# Altium project Sayma_RTM.PrjPcb (part 2 of 11)

## Sheet FPGA_7A35T.SchDoc: Sayma RTM
size 420 x 297 mm; $$Internal___BlkDate: 23:43:20_12-13-18; $$Internal_NAME_PLACEHOLDER: a2sheet_WUT; $$Internal_Resolution: 00001mm; $$NotCommonProperty_@NAME: FPGA_7A35T; $$NotCommonProperty_@PRINTORDER: 9; $$NotCommonProperty_@SHEET: 1; $$NotCommonProperty_@SHEETTOTAL: 16; CmpIndex: 0; Drawing Author: G.Kasprowicz; Drawing Number: Sayma RTM; Drawing Project: 8 channel SAWG; Drawing Revision: 2.0; SymIndex: 2228; Author: G.Kasprowicz; CompanyName: WUT ISE; DrawnBy: G.Kasprowicz; Organization: WUT ISE; Address1: PW ISE; Address2: Nowowiejska 15/19 00-665 Warsaw; Address3: gkasprow@gmail.com; DocumentNumber: 8; Revision: 1.0; SheetNumber: 8; SheetTotal: 18; ModifiedBy: -; CheckedDate: -; Title2: FPGA IO banks; DivGrp: WUT ISE; Designer: G.Kasprowicz; ModifiedDate: -; ProjectName: Sensor Box
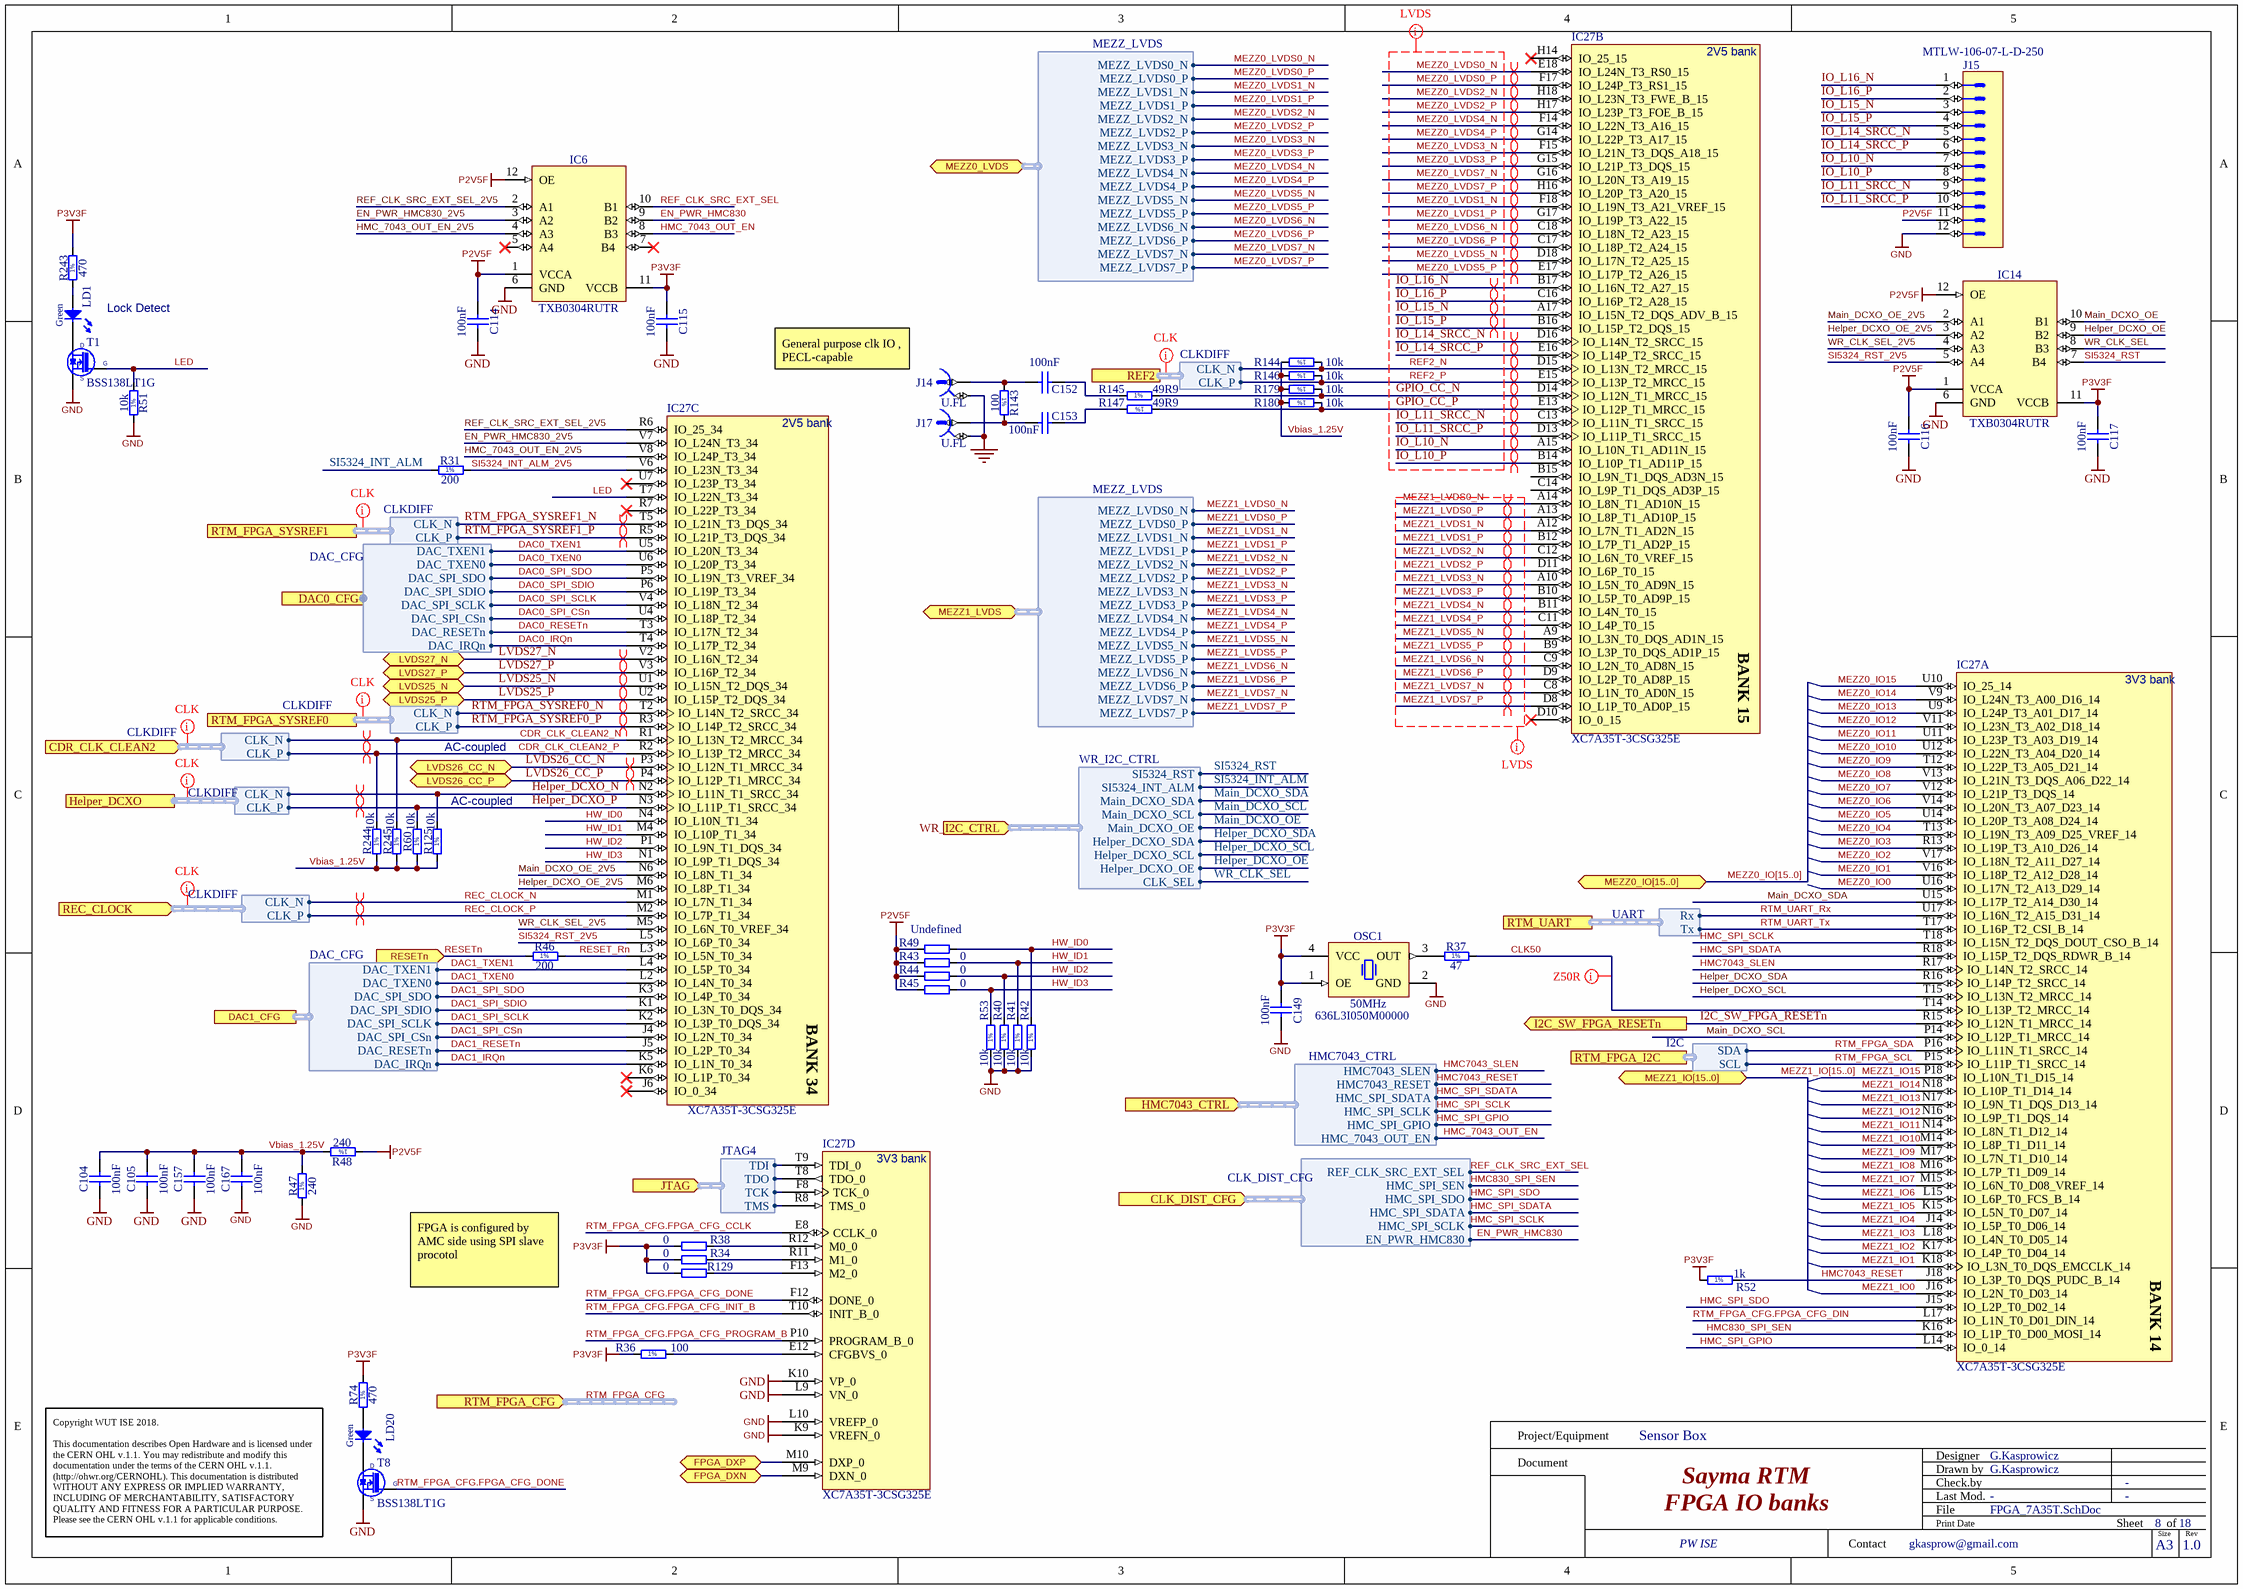
[diagram p1: FPGA_7A35T.SchDoc]

### Parts
C104  100nF  [CAPC0603X33N]
C105  100nF  [CAPC0603X33N]
C114  100nF  [CAPC0603X33N]
C115  100nF  [CAPC0603X33N]
C116  100nF  [CAPC0603X33N]
C117  100nF  [CAPC0603X33N]
C149  100nF  [CAPC0603X33N]
C152  100nF  [CAPC1005X55N]
C153  100nF  [CAPC1005X55N]
C157  100nF  [CAPC0603X33N]
C167  100nF  [CAPC0603X33N]
IC6  TXB0304RUTR  [TEXAS_RUT (R-PUQFN-N12)]
IC14  TXB0304RUTR  [TEXAS_RUT (R-PUQFN-N12)]
IC27  XC7A35T-3CSG325E  [CSG325]  (parts A,B,C,D of 9)
J14  U.FL  [HIROSE_U.FL-R-SMT-1(10)]
J15  Manufacturer Part Number: MTLW-106-07-L-D-250  [SAMTEC_MTLW-106-07-L-D-250]  (hidden comment: Header 12)
J17  U.FL  [HIROSE_U.FL-R-SMT-1(10)]
LD1  Green  [LED_KINGBRIGHT_KPH-1608CGCK]
LD20  Green  [LED_KINGBRIGHT_KPH-1608CGCK]
OSC1  50MHz  Manufacturer Part Number: 636L3I050M00000  [OSCSC254P320X500X130-4N]
R31  200  [RESC1005X40N]
R34  0  [RESC1005X40N]
R36  100  [RESC1005X40N]
R37  47  [RESC1005X40N]
R38  0  [RESC1005X40N]
R40  10k  [RESC1005X40N]
R41  10k  [RESC1005X40N]
R42  10k  [RESC1005X40N]
R43  0  [RESC1005X40N]
R44  0  [RESC1005X40N]
R45  0  [RESC1005X40N]
R46  200  [RESC1005X40N]
R47  240  [RESC1005X40N]
R48  240  [RESC1005X40N]
R49  Undefined  [RESC1005X40N]
R51  10k  [RESC1005X40N]
R52  1k  [RESC1005X40N]
R53  10k  [RESC1005X40N]
R60  10k  [RESC1005X40N]
R74  470  [RESC1005X40N]
R125  10k  [RESC1005X40N]
R129  0  [RESC1005X40N]
R143  100  [RESC1005X40N]
R144  10k  [RESC1005X40N]
R145  49R9  [RESC1005X40N]
R146  10k  [RESC1005X40N]
R147  49R9  [RESC1005X40N]
R179  10k  [RESC1005X40N]
R180  10k  [RESC1005X40N]
R243  470  [RESC1005X40N]
R244  10k  [RESC1005X40N]
R245  10k  [RESC1005X40N]
T1  BSS138LT1G  [SOT95P240X110-3N]
T8  BSS138LT1G  [SOT95P240X110-3N]

### Ports
CDR_CLK_CLEAN2 (in, harness CLKDIFF), CLK_DIST_CFG (in, harness CLK_DIST_CFG), DAC0_CFG (in, harness DAC_CFG), DAC1_CFG (harness DAC_CFG), FPGA_DXN (bidir), FPGA_DXP (bidir), Helper_DCXO (harness CLKDIFF), HMC7043_CTRL (in, harness HMC7043_CTRL), I2C_SW_FPGA_RESETn (out), JTAG (in, harness JTAG4), LVDS25_N (bidir), LVDS25_P (bidir), LVDS26_CC_N (bidir), LVDS26_CC_P (bidir), LVDS27_N (bidir), LVDS27_P (bidir), MEZZ0_IO[15..0] (bidir), MEZZ0_LVDS (bidir, harness MEZZ_LVDS), MEZZ1_IO[15..0] (bidir), MEZZ1_LVDS (bidir, harness MEZZ_LVDS), REC_CLOCK (in, harness CLKDIFF), REF2 (harness CLKDIFF), RESETn (in), RTM_FPGA_CFG (in, harness RTM_FPGA_CFG), RTM_FPGA_I2C (harness I2C), RTM_FPGA_SYSREF0 (harness CLKDIFF), RTM_FPGA_SYSREF1 (harness CLKDIFF), RTM_UART (harness UART), WR_I2C_CTRL (in, harness WR_I2C_CTRL)

### Harnesses
JTAG4: TCK, TDI, TDO, TMS
CLKDIFF: CLK_N, CLK_P
UART: Rx, Tx
I2C: SCL, SDA
DAC_CFG: DAC_IRQn, DAC_RESETn, DAC_SPI_CSn, DAC_SPI_SCLK, DAC_SPI_SDIO, DAC_SPI_SDO, DAC_TXEN0, DAC_TXEN1
CLK_DIST_CFG: HMC_SPI_SCLK, HMC_SPI_SDATA, HMC_SPI_SDO, HMC_SPI_SEN, REF_CLK_SRC_EXT_SEL, EN_PWR_HMC830
WR_I2C_CTRL: CLK_SEL, Helper_DCXO_OE, Helper_DCXO_SCL, Helper_DCXO_SDA, Main_DCXO_OE, Main_DCXO_SCL, Main_DCXO_SDA, SI5324_INT_ALM, SI5324_RST
HMC7043_CTRL: HMC_7043_OUT_EN, HMC_SPI_GPIO, HMC_SPI_SCLK, HMC_SPI_SDATA, HMC7043_RESET, HMC7043_SLEN
MEZZ_LVDS: MEZZ_LVDS0_N, MEZZ_LVDS0_P, MEZZ_LVDS1_N, MEZZ_LVDS1_P, MEZZ_LVDS2_N, MEZZ_LVDS2_P, MEZZ_LVDS3_N, MEZZ_LVDS3_P, MEZZ_LVDS4_N, MEZZ_LVDS4_P, MEZZ_LVDS5_N, MEZZ_LVDS5_P, MEZZ_LVDS6_N, MEZZ_LVDS6_P, MEZZ_LVDS7_N, MEZZ_LVDS7_P

### Nets
GND: C104.2 C105.2 C114.2 C115.2 C116.2 C117.2 C149.1 C157.2 C167.2 IC6.6(GND) IC14.6(GND) IC27.K9(VREFN_0) IC27.K10(VP_0) IC27.L9(VN_0) IC27.L10(VREFP_0) J14.2 J15.12 J17.2 OSC1.2(GND) R40.1 R41.1 R42.1 R47.1 R51.1 R53.1 T1.2(S) T8.2(S)
P2V5F: C114.1 C116.1 IC6.1(VCCA) IC6.12(OE) IC14.1(VCCA) IC14.12(OE) J15.11 R43.1 R44.1 R45.1 R48.1 R49.1
P3V3F: C115.1 C117.1 C149.2 IC6.11(VCCB) IC14.11(VCCB) OSC1.1(OE) OSC1.4(VCC) R34.1 R36.1 R38.1 R52.1 R74.2 R129.1 R243.2
CDR_CLK_CLEAN2_N: IC27.R1(IO_L13N_T2_MRCC_34) R245.2 ; port CDR_CLK_CLEAN2.CLK_N
CDR_CLK_CLEAN2_P: IC27.R2(IO_L13P_T2_MRCC_34) R244.2 ; port CDR_CLK_CLEAN2.CLK_P
CLK50: IC27.T14(IO_L13P_T2_MRCC_14) R37.2
DAC0_IRQn: IC27.T4(IO_L17P_T2_34) ; port DAC0_CFG.DAC_IRQn
DAC0_RESETn: IC27.T3(IO_L17N_T2_34) ; port DAC0_CFG.DAC_RESETn
DAC0_SPI_CSn: IC27.U4(IO_L18P_T2_34) ; port DAC0_CFG.DAC_SPI_CSn
DAC0_SPI_SCLK: IC27.V4(IO_L18N_T2_34) ; port DAC0_CFG.DAC_SPI_SCLK
DAC0_SPI_SDIO: IC27.P6(IO_L19P_T3_34) ; port DAC0_CFG.DAC_SPI_SDIO
DAC0_SPI_SDO: IC27.P5(IO_L19N_T3_VREF_34) ; port DAC0_CFG.DAC_SPI_SDO
DAC0_TXEN0: IC27.U6(IO_L20P_T3_34) ; port DAC0_CFG.DAC_TXEN0
DAC0_TXEN1: IC27.U5(IO_L20N_T3_34) ; port DAC0_CFG.DAC_TXEN1
DAC1_IRQn: IC27.K5(IO_L1N_T0_34) ; port DAC1_CFG.DAC_IRQn
DAC1_RESETn: IC27.J5(IO_L2P_T0_34) ; port DAC1_CFG.DAC_RESETn
DAC1_SPI_CSn: IC27.J4(IO_L2N_T0_34) ; port DAC1_CFG.DAC_SPI_CSn
DAC1_SPI_SCLK: IC27.K2(IO_L3P_T0_DQS_34) ; port DAC1_CFG.DAC_SPI_SCLK
DAC1_SPI_SDIO: IC27.K1(IO_L3N_T0_DQS_34) ; port DAC1_CFG.DAC_SPI_SDIO
DAC1_SPI_SDO: IC27.K3(IO_L4P_T0_34) ; port DAC1_CFG.DAC_SPI_SDO
DAC1_TXEN0: IC27.L2(IO_L4N_T0_34) ; port DAC1_CFG.DAC_TXEN0
DAC1_TXEN1: IC27.L4(IO_L5P_T0_34) ; port DAC1_CFG.DAC_TXEN1
EN_PWR_HMC830: IC6.9(B2) ; port CLK_DIST_CFG.EN_PWR_HMC830
EN_PWR_HMC830_2V5: IC6.3(A2) IC27.V7(IO_L24N_T3_34)
FPGA_DXN: IC27.M9(DXN_0) ; port FPGA_DXN
FPGA_DXP: IC27.M10(DXP_0) ; port FPGA_DXP
GPIO_CC_N: IC27.D14(IO_L12N_T1_MRCC_15) R145.2 R179.1
GPIO_CC_P: IC27.E13(IO_L12P_T1_MRCC_15) R147.1 R180.1
Helper_DCXO_N: IC27.N2(IO_L11N_T1_SRCC_34) R125.2 ; port Helper_DCXO.CLK_N
Helper_DCXO_OE: IC14.9(B2) ; port WR_I2C_CTRL.Helper_DCXO_OE
Helper_DCXO_OE_2V5: IC14.3(A2) IC27.M6(IO_L8P_T1_34)
Helper_DCXO_P: IC27.N3(IO_L11P_T1_SRCC_34) R60.2 ; port Helper_DCXO.CLK_P
Helper_DCXO_SCL: IC27.T15(IO_L13N_T2_MRCC_14) ; port WR_I2C_CTRL.Helper_DCXO_SCL
Helper_DCXO_SDA: IC27.R16(IO_L14P_T2_SRCC_14) ; port WR_I2C_CTRL.Helper_DCXO_SDA
HMC830_SPI_SEN: IC27.K16(IO_L1P_T0_D00_MOSI_14) ; port CLK_DIST_CFG.HMC_SPI_SEN
HMC7043_RESET: IC27.J18(IO_L3P_T0_DQS_PUDC_B_14) R52.2 ; port HMC7043_CTRL.HMC7043_RESET
HMC7043_SLEN: IC27.R17(IO_L14N_T2_SRCC_14) ; port HMC7043_CTRL.HMC7043_SLEN
HMC_7043_OUT_EN: IC6.8(B3) ; port HMC7043_CTRL.HMC_7043_OUT_EN
HMC_7043_OUT_EN_2V5: IC6.4(A3) IC27.V8(IO_L24P_T3_34)
HMC_SPI_GPIO: IC27.L14(IO_0_14) ; port HMC7043_CTRL.HMC_SPI_GPIO
HMC_SPI_SCLK: IC27.T18(IO_L15N_T2_DQS_DOUT_CSO_B_14) ; port CLK_DIST_CFG.HMC_SPI_SCLK, port HMC7043_CTRL.HMC_SPI_SCLK
HMC_SPI_SDATA: IC27.R18(IO_L15P_T2_DQS_RDWR_B_14) ; port CLK_DIST_CFG.HMC_SPI_SDATA, port HMC7043_CTRL.HMC_SPI_SDATA
HMC_SPI_SDO: IC27.J15(IO_L2P_T0_D02_14) ; port CLK_DIST_CFG.HMC_SPI_SDO
HW_ID0: IC27.N4(IO_L10N_T1_34) R42.2 R49.2
HW_ID1: IC27.M4(IO_L10P_T1_34) R41.2 R43.2
HW_ID2: IC27.P1(IO_L9N_T1_DQS_34) R40.2 R44.2
HW_ID3: IC27.N1(IO_L9P_T1_DQS_34) R45.2 R53.2
I2C_SW_FPGA_RESETn: IC27.R15(IO_L12N_T1_MRCC_14) ; port I2C_SW_FPGA_RESETn
IO_L10_N: IC27.A15(IO_L10N_T1_AD11N_15) J15.7
IO_L10_P: IC27.B14(IO_L10P_T1_AD11P_15) J15.8
IO_L11_SRCC_N: IC27.C13(IO_L11N_T1_SRCC_15) J15.9
IO_L11_SRCC_P: IC27.D13(IO_L11P_T1_SRCC_15) J15.10
IO_L14_SRCC_N: IC27.D16(IO_L14N_T2_SRCC_15) J15.5
IO_L14_SRCC_P: IC27.E16(IO_L14P_T2_SRCC_15) J15.6
IO_L15_N: IC27.A17(IO_L15N_T2_DQS_ADV_B_15) J15.3
IO_L15_P: IC27.B16(IO_L15P_T2_DQS_15) J15.4
IO_L16_N: IC27.B17(IO_L16N_T2_A27_15) J15.1
IO_L16_P: IC27.C16(IO_L16P_T2_A28_15) J15.2
JTAG.TCK: IC27.F8(TCK_0) ; port JTAG.TCK
JTAG.TDI: IC27.T9(TDI_0) ; port JTAG.TDI
JTAG.TDO: IC27.T8(TDO_0) ; port JTAG.TDO
JTAG.TMS: IC27.R8(TMS_0) ; port JTAG.TMS
LED: IC27.T7(IO_L22N_T3_34) R51.2 T1.1(G)
LVDS25_N: IC27.U1(IO_L15N_T2_DQS_34) ; port LVDS25_N  [project net AMC_LVDS.LVDS25_N]
LVDS25_P: IC27.U2(IO_L15P_T2_DQS_34) ; port LVDS25_P  [project net AMC_LVDS.LVDS25_P]
LVDS26_CC_N: IC27.P3(IO_L12N_T1_MRCC_34) ; port LVDS26_CC_N  [project net AMC_LVDS.LVDS26_CC_N]
LVDS26_CC_P: IC27.P4(IO_L12P_T1_MRCC_34) ; port LVDS26_CC_P  [project net AMC_LVDS.LVDS26_CC_P]
LVDS27_N: IC27.V2(IO_L16N_T2_34) ; port LVDS27_N  [project net AMC_LVDS.LVDS27_N]
LVDS27_P: IC27.V3(IO_L16P_T2_34) ; port LVDS27_P  [project net AMC_LVDS.LVDS27_P]
Main_DCXO_OE: IC14.10(B1) ; port WR_I2C_CTRL.Main_DCXO_OE
Main_DCXO_OE_2V5: IC14.2(A1) IC27.N6(IO_L8N_T1_34)
Main_DCXO_SCL: IC27.P14(IO_L12P_T1_MRCC_14) ; port WR_I2C_CTRL.Main_DCXO_SCL
Main_DCXO_SDA: IC27.U15(IO_L17P_T2_A14_D30_14) ; port WR_I2C_CTRL.Main_DCXO_SDA
MEZZ0_IO0: IC27.U16(IO_L17N_T2_A13_D29_14)
MEZZ0_IO1: IC27.V16(IO_L18P_T2_A12_D28_14)
MEZZ0_IO2: IC27.V17(IO_L18N_T2_A11_D27_14)
MEZZ0_IO3: IC27.R13(IO_L19P_T3_A10_D26_14)
MEZZ0_IO4: IC27.T13(IO_L19N_T3_A09_D25_VREF_14)
MEZZ0_IO5: IC27.U14(IO_L20P_T3_A08_D24_14)
MEZZ0_IO6: IC27.V14(IO_L20N_T3_A07_D23_14)
MEZZ0_IO7: IC27.V12(IO_L21P_T3_DQS_14)
MEZZ0_IO8: IC27.V13(IO_L21N_T3_DQS_A06_D22_14)
MEZZ0_IO9: IC27.T12(IO_L22P_T3_A05_D21_14)
MEZZ0_IO10: IC27.U12(IO_L22N_T3_A04_D20_14)
MEZZ0_IO11: IC27.U11(IO_L23P_T3_A03_D19_14)
MEZZ0_IO12: IC27.V11(IO_L23N_T3_A02_D18_14)
MEZZ0_IO13: IC27.U9(IO_L24P_T3_A01_D17_14)
MEZZ0_IO14: IC27.V9(IO_L24N_T3_A00_D16_14)
MEZZ0_IO15: IC27.U10(IO_25_14)
MEZZ0_LVDS0_N: IC27.E18(IO_L24N_T3_RS0_15) ; port MEZZ0_LVDS.MEZZ_LVDS0_N
MEZZ0_LVDS0_P: IC27.F17(IO_L24P_T3_RS1_15) ; port MEZZ0_LVDS.MEZZ_LVDS0_P
MEZZ0_LVDS1_N: IC27.F18(IO_L19N_T3_A21_VREF_15) ; port MEZZ0_LVDS.MEZZ_LVDS1_N
MEZZ0_LVDS1_P: IC27.G17(IO_L19P_T3_A22_15) ; port MEZZ0_LVDS.MEZZ_LVDS1_P
MEZZ0_LVDS2_N: IC27.H18(IO_L23N_T3_FWE_B_15) ; port MEZZ0_LVDS.MEZZ_LVDS2_N
MEZZ0_LVDS2_P: IC27.H17(IO_L23P_T3_FOE_B_15) ; port MEZZ0_LVDS.MEZZ_LVDS2_P
MEZZ0_LVDS3_N: IC27.F15(IO_L21N_T3_DQS_A18_15) ; port MEZZ0_LVDS.MEZZ_LVDS3_N
MEZZ0_LVDS3_P: IC27.G15(IO_L21P_T3_DQS_15) ; port MEZZ0_LVDS.MEZZ_LVDS3_P
MEZZ0_LVDS4_N: IC27.F14(IO_L22N_T3_A16_15) ; port MEZZ0_LVDS.MEZZ_LVDS4_N
MEZZ0_LVDS4_P: IC27.G14(IO_L22P_T3_A17_15) ; port MEZZ0_LVDS.MEZZ_LVDS4_P
MEZZ0_LVDS5_N: IC27.D18(IO_L17N_T2_A25_15) ; port MEZZ0_LVDS.MEZZ_LVDS5_N
MEZZ0_LVDS5_P: IC27.E17(IO_L17P_T2_A26_15) ; port MEZZ0_LVDS.MEZZ_LVDS5_P
MEZZ0_LVDS6_N: IC27.C18(IO_L18N_T2_A23_15) ; port MEZZ0_LVDS.MEZZ_LVDS6_N
MEZZ0_LVDS6_P: IC27.C17(IO_L18P_T2_A24_15) ; port MEZZ0_LVDS.MEZZ_LVDS6_P
MEZZ0_LVDS7_N: IC27.G16(IO_L20N_T3_A19_15) ; port MEZZ0_LVDS.MEZZ_LVDS7_N
MEZZ0_LVDS7_P: IC27.H16(IO_L20P_T3_A20_15) ; port MEZZ0_LVDS.MEZZ_LVDS7_P
MEZZ1_IO0: IC27.J16(IO_L2N_T0_D03_14)
MEZZ1_IO1: IC27.K18(IO_L3N_T0_DQS_EMCCLK_14)
MEZZ1_IO2: IC27.K17(IO_L4P_T0_D04_14)
MEZZ1_IO3: IC27.L18(IO_L4N_T0_D05_14)
MEZZ1_IO4: IC27.J14(IO_L5P_T0_D06_14)
MEZZ1_IO5: IC27.K15(IO_L5N_T0_D07_14)
MEZZ1_IO6: IC27.L15(IO_L6P_T0_FCS_B_14)
MEZZ1_IO7: IC27.M15(IO_L6N_T0_D08_VREF_14)
MEZZ1_IO8: IC27.M16(IO_L7P_T1_D09_14)
MEZZ1_IO9: IC27.M17(IO_L7N_T1_D10_14)
MEZZ1_IO10: IC27.M14(IO_L8P_T1_D11_14)
MEZZ1_IO11: IC27.N14(IO_L8N_T1_D12_14)
MEZZ1_IO12: IC27.N16(IO_L9P_T1_DQS_14)
MEZZ1_IO13: IC27.N17(IO_L9N_T1_DQS_D13_14)
MEZZ1_IO14: IC27.N18(IO_L10P_T1_D14_14)
MEZZ1_IO15: IC27.P18(IO_L10N_T1_D15_14)
MEZZ1_LVDS0_N: IC27.A14(IO_L8N_T1_AD10N_15) ; port MEZZ1_LVDS.MEZZ_LVDS0_N
MEZZ1_LVDS0_P: IC27.A13(IO_L8P_T1_AD10P_15) ; port MEZZ1_LVDS.MEZZ_LVDS0_P
MEZZ1_LVDS1_N: IC27.A12(IO_L7N_T1_AD2N_15) ; port MEZZ1_LVDS.MEZZ_LVDS1_N
MEZZ1_LVDS1_P: IC27.B12(IO_L7P_T1_AD2P_15) ; port MEZZ1_LVDS.MEZZ_LVDS1_P
MEZZ1_LVDS2_N: IC27.C12(IO_L6N_T0_VREF_15) ; port MEZZ1_LVDS.MEZZ_LVDS2_N
MEZZ1_LVDS2_P: IC27.D11(IO_L6P_T0_15) ; port MEZZ1_LVDS.MEZZ_LVDS2_P
MEZZ1_LVDS3_N: IC27.A10(IO_L5N_T0_AD9N_15) ; port MEZZ1_LVDS.MEZZ_LVDS3_N
MEZZ1_LVDS3_P: IC27.B10(IO_L5P_T0_AD9P_15) ; port MEZZ1_LVDS.MEZZ_LVDS3_P
MEZZ1_LVDS4_N: IC27.B11(IO_L4N_T0_15) ; port MEZZ1_LVDS.MEZZ_LVDS4_N
MEZZ1_LVDS4_P: IC27.C11(IO_L4P_T0_15) ; port MEZZ1_LVDS.MEZZ_LVDS4_P
MEZZ1_LVDS5_N: IC27.A9(IO_L3N_T0_DQS_AD1N_15) ; port MEZZ1_LVDS.MEZZ_LVDS5_N
MEZZ1_LVDS5_P: IC27.B9(IO_L3P_T0_DQS_AD1P_15) ; port MEZZ1_LVDS.MEZZ_LVDS5_P
MEZZ1_LVDS6_N: IC27.C9(IO_L2N_T0_AD8N_15) ; port MEZZ1_LVDS.MEZZ_LVDS6_N
MEZZ1_LVDS6_P: IC27.D9(IO_L2P_T0_AD8P_15) ; port MEZZ1_LVDS.MEZZ_LVDS6_P
MEZZ1_LVDS7_N: IC27.C8(IO_L1N_T0_AD0N_15) ; port MEZZ1_LVDS.MEZZ_LVDS7_N
MEZZ1_LVDS7_P: IC27.D8(IO_L1P_T0_AD0P_15) ; port MEZZ1_LVDS.MEZZ_LVDS7_P
REC_CLOCK_N: IC27.M1(IO_L7N_T1_34) ; port REC_CLOCK.CLK_N  [project net REC_CLOCK_C_N]
REC_CLOCK_P: IC27.M2(IO_L7P_T1_34) ; port REC_CLOCK.CLK_P  [project net REC_CLOCK_C_P]
REF2_N: IC27.D15(IO_L13N_T2_MRCC_15) R144.1 ; port REF2.CLK_N
REF2_P: IC27.E15(IO_L13P_T2_MRCC_15) R146.1 ; port REF2.CLK_P
REF_CLK_SRC_EXT_SEL: IC6.10(B1) ; port CLK_DIST_CFG.REF_CLK_SRC_EXT_SEL
REF_CLK_SRC_EXT_SEL_2V5: IC6.2(A1) IC27.R6(IO_25_34)
RESET_Rn: IC27.L3(IO_L5N_T0_34) R46.2
RESETn: R46.1 ; port RESETn
RTM_FPGA_CFG.FPGA_CFG_CCLK: IC27.E8(CCLK_0)
RTM_FPGA_CFG.FPGA_CFG_DIN: IC27.L17(IO_L1N_T0_D01_DIN_14)
RTM_FPGA_CFG.FPGA_CFG_DONE: IC27.F12(DONE_0) T8.1(G)
RTM_FPGA_CFG.FPGA_CFG_INIT_B: IC27.T10(INIT_B_0)
RTM_FPGA_CFG.FPGA_CFG_PROGRAM_B: IC27.P10(PROGRAM_B_0)
RTM_FPGA_SCL: IC27.P15(IO_L11P_T1_SRCC_14) ; port RTM_FPGA_I2C.SCL
RTM_FPGA_SDA: IC27.P16(IO_L11N_T1_SRCC_14) ; port RTM_FPGA_I2C.SDA
RTM_FPGA_SYSREF0_N: IC27.T2(IO_L14N_T2_SRCC_34) ; port RTM_FPGA_SYSREF0.CLK_N
RTM_FPGA_SYSREF0_P: IC27.R3(IO_L14P_T2_SRCC_34) ; port RTM_FPGA_SYSREF0.CLK_P
RTM_FPGA_SYSREF1_N: IC27.T5(IO_L21N_T3_DQS_34) ; port RTM_FPGA_SYSREF1.CLK_N
RTM_FPGA_SYSREF1_P: IC27.R5(IO_L21P_T3_DQS_34) ; port RTM_FPGA_SYSREF1.CLK_P
RTM_UART_Rx: IC27.U17(IO_L16N_T2_A15_D31_14) ; port RTM_UART.Rx  [project net RTM_UART.Rx]
RTM_UART_Tx: IC27.T17(IO_L16P_T2_CSI_B_14) ; port RTM_UART.Tx  [project net RTM_UART.Tx]
SI5324_INT_ALM: R31.1 ; port WR_I2C_CTRL.SI5324_INT_ALM
SI5324_INT_ALM_2V5: IC27.V6(IO_L23N_T3_34) R31.2
SI5324_RST: IC14.7(B4) ; port WR_I2C_CTRL.SI5324_RST
SI5324_RST_2V5: IC14.5(A4) IC27.L5(IO_L6P_T0_34)
Vbias_1.25V: C104.1 C105.1 C157.1 C167.1 R47.2 R48.2 R60.1 R125.1 R144.2 R146.2 R179.2 R180.2 R244.1 R245.1
WR_CLK_SEL: IC14.8(B3) ; port WR_I2C_CTRL.CLK_SEL
WR_CLK_SEL_2V5: IC14.4(A3) IC27.M5(IO_L6N_T0_VREF_34)
NetC152_1: C152.1 J14.1 R143.1
NetC152_2: C152.2 R145.1
NetC153_1: C153.1 J17.1 R143.2
NetC153_2: C153.2 R147.2
NetIC27_E12: IC27.E12(CFGBVS_0) R36.2
NetIC27_F13: IC27.F13(M2_0) R129.2
NetIC27_R11: IC27.R11(M1_0) R34.2
NetIC27_R12: IC27.R12(M0_0) R38.2
NetLD1_1: LD1.1(C) T1.3(D)
NetLD1_2: LD1.2(A) R243.1
NetLD20_1: LD20.1(C) T8.3(D)
NetLD20_2: LD20.2(A) R74.1
NetOSC1_3: OSC1.3(OUT) R37.1

Not connected (* = marked no-connect by the designer): IC6 5(A4)* 7(B4)*; IC27 B15(IO_L9N_T1_DQS_AD3N_15) C14(IO_L9P_T1_DQS_AD3P_15) D10(IO_0_15)* H14(IO_25_15)* J6(IO_0_34)* K6(IO_L1P_T0_34)* R7(IO_L22P_T3_34)* U7(IO_L23P_T3_34)*

### Buses and harness runs
bus MEZZ0_IO[15..0] = port MEZZ0_IO[15..0]
bus MEZZ1_IO[15..0] = port MEZZ1_IO[15..0]
harness RTM_FPGA_CFG = port RTM_FPGA_CFG

### Layout directives
net class CLK: (no net found under the mark)
differential pair: AMC_LVDS.LVDS25_N, AMC_LVDS.LVDS25_P, AMC_LVDS.LVDS26_CC_N, AMC_LVDS.LVDS26_CC_P, AMC_LVDS.LVDS27_N, AMC_LVDS.LVDS27_P, CDR_CLK_CLEAN2_N, CDR_CLK_CLEAN2_P, GPIO_CC_N, GPIO_CC_P, Helper_DCXO_N, Helper_DCXO_P, IO_L10_N, IO_L10_P, IO_L11_SRCC_N, IO_L11_SRCC_P, IO_L14_SRCC_N, IO_L14_SRCC_P, IO_L15_N, IO_L15_P, IO_L16_N, IO_L16_P, MEZZ0_LVDS0_N, MEZZ0_LVDS0_P, MEZZ0_LVDS1_N, MEZZ0_LVDS1_P, MEZZ0_LVDS2_N, MEZZ0_LVDS2_P, MEZZ0_LVDS3_N, MEZZ0_LVDS3_P, MEZZ0_LVDS4_N, MEZZ0_LVDS4_P, MEZZ0_LVDS5_N, MEZZ0_LVDS5_P, MEZZ0_LVDS6_N, MEZZ0_LVDS6_P, MEZZ0_LVDS7_N, MEZZ0_LVDS7_P, MEZZ1_LVDS0_N, MEZZ1_LVDS0_P, MEZZ1_LVDS1_N, MEZZ1_LVDS1_P, MEZZ1_LVDS2_N, MEZZ1_LVDS2_P, MEZZ1_LVDS3_N, MEZZ1_LVDS3_P, MEZZ1_LVDS4_N, MEZZ1_LVDS4_P, MEZZ1_LVDS5_N, MEZZ1_LVDS5_P, MEZZ1_LVDS6_N, MEZZ1_LVDS6_P, MEZZ1_LVDS7_N, MEZZ1_LVDS7_P, REC_CLOCK_C_N, REC_CLOCK_C_P, REF2_N, REF2_P, RTM_FPGA_SYSREF0_N, RTM_FPGA_SYSREF0_P, RTM_FPGA_SYSREF1_N, RTM_FPGA_SYSREF1_P
net class LVDS: GPIO_CC_N, GPIO_CC_P, IO_L10_N, IO_L10_P, IO_L11_SRCC_N, IO_L11_SRCC_P, IO_L14_SRCC_N, IO_L14_SRCC_P, IO_L15_N, IO_L15_P, IO_L16_N, IO_L16_P, MEZZ0_LVDS0_N, MEZZ0_LVDS0_P, MEZZ0_LVDS1_N, MEZZ0_LVDS1_P, MEZZ0_LVDS2_N, MEZZ0_LVDS2_P, MEZZ0_LVDS3_N, MEZZ0_LVDS3_P, MEZZ0_LVDS4_N, MEZZ0_LVDS4_P, MEZZ0_LVDS5_N, MEZZ0_LVDS5_P, MEZZ0_LVDS6_N, MEZZ0_LVDS6_P, MEZZ0_LVDS7_N, MEZZ0_LVDS7_P, MEZZ1_LVDS0_N, MEZZ1_LVDS0_P, MEZZ1_LVDS1_N, MEZZ1_LVDS1_P, MEZZ1_LVDS2_N, MEZZ1_LVDS2_P, MEZZ1_LVDS3_N, MEZZ1_LVDS3_P, MEZZ1_LVDS4_N, MEZZ1_LVDS4_P, MEZZ1_LVDS5_N, MEZZ1_LVDS5_P, MEZZ1_LVDS6_N, MEZZ1_LVDS6_P, MEZZ1_LVDS7_N, MEZZ1_LVDS7_P, REF2_N, REF2_P
net class Z50R: CLK50

### Notes on the sheet
- 2V5 bank
- Lock Detect
- (near J14) General purpose clk IO , PECL-capable
- 3V3 bank
- AC-coupled
- FPGA is configured by AMC side using SPI slave procotol
- Project/Equipment
- Document
- Designer
- Drawn by
- Check.by
- Copyright WUT ISE 2018.
  This documentation describes Open Hardware and is licensed under the CERN OHL v.1.1. You may redistribute and modify this documentation under the terms of the CERN OHL v.1.1. (http://ohwr.org/CERNOHL). This documentation is distributed WITHOUT ANY EXPRESS OR IMPLIED WARRANTY, INCLUDING OF MERCHANTABILITY, SATISFACTORY QUALITY AND FITNESS FOR A PARTICULAR PURPOSE. Please see the CERN OHL v.1.1 for applicable conditions.
- Contact
- File
- Last Mod.
- Print Date
- Sheet
- Size
- A3
- of
- Rev
- (in symbol CMP-0383-00015-1, part A) BANK 14
- (in symbol CMP-0383-00015-1, part B) BANK 15
- (in symbol CMP-0383-00015-1, part C) BANK 34
- (in symbol R0402_1K_1%_0.0625W_100PPM) 1%
- (in symbol R0402_10K_1%_0.0625W_100PPM) 1%
- (in symbol R0402_47R_1%_0.0625W_100PPM) 1%
- (in symbol R0402_49R9_1%_0.0625W_100PPM) 1%
- (in symbol R0402_100R_1%_0.1W_100PPM) 1%
- (in symbol R0402_100R_1%_0.0625W_100PPM) 1%
- (in symbol R0402_200R_1%_0.0625W_100PPM) 1%
- (in symbol R0402_240R_1%_0.0625W_100PPM) 1%
- (in symbol R0402_470R_1%_0.0625W_100PPM) 1%

### Library data of the parts
C104 C105 C149 C157 C167 = CC0201_100NF_6.3V_10%_X5R: Non-polarised capacitor; Manufacturer: GENERIC; Manufacturer1 Part Number: 02016D104KAT2A; Part Description: SMD Multilayer Chip Ceramic Capacitor; TC: X5R; Tolerance: ±10%; Voltage: 6.3V; Case: 0201; Manufacturer Part Number: CC0201_100NF_6.3V_10%_X5R; Manufacturer1 Example: AVX; Part Number: CC0201_100NF_6.3V_10%_X5R; Pin Count: 2; SMD: Yes; Status: Not Recommended; Value: 100nF; Component Kind: Standard; Component Type: Standard; Mounted: Yes; Socket: No; Sense: No; Manufacturer1 ComponentHeight: 0.33mm; HelpURL: \\cern.ch\dfs\Applications\Altium\Datasheets\CC0201_X5R_AVX.pdf; Author: CERN DEM JLC; CreateDate: 03.12.2007; LatestRevisionDate: 03.12.2007
C114-C117 = CC0201_100NF_6.3V_10%_X5R: Non-polarised capacitor; Manufacturer: GENERIC; Part Description: SMD Multilayer Chip Ceramic Capacitor; Manufacturer1 Part Number: 02016D104KAT2A; Tolerance: ±10%; Voltage: 6.3V; TC: X5R; Manufacturer Part Number: CC0201_100NF_6.3V_10%_X5R; Part Number: CC0201_100NF_6.3V_10%_X5R; Value: 100nF; Component Kind: Standard; Component Type: Standard; Pin Count: 2; Status: Not Recommended; Case: 0201; Mounted: Yes; Socket: No; SMD: Yes; Sense: No; Manufacturer1 Example: AVX; Manufacturer1 ComponentHeight: 0.33mm; HelpURL: \\cern.ch\dfs\Applications\Altium\Datasheets\CC0201_X5R_AVX.pdf; Author: CERN DEM JLC; CreateDate: 03.12.2007; LatestRevisionDate: 03.12.2007
C152 C153 = CC0402_100NF_16V_10%_X5R: Non-polarised capacitor; Manufacturer: GENERIC; Manufacturer1 Part Number: GRM155R61C104KA88D; Part Description: SMD Multilayer Chip Ceramic Capacitor; TC: X5R; Tolerance: ±10%; Voltage: 16V; Case: 0402; Manufacturer Part Number: CC0402_100NF_16V_10%_X5R; Manufacturer1 Example: MURATA; Part Number: CC0402_100NF_16V_10%_X5R; Pin Count: 2; SMD: Yes; Status: None; Value: 100nF; Component Kind: Standard; Component Type: Standard; Mounted: Yes; Socket: No; Sense: No; Manufacturer1 ComponentHeight: 0.55mm; HelpURL: \\cern.ch\dfs\Applications\Altium\Datasheets\CC0402_X5R_MURATA_GRM.pdf; Author: CERN DEM JLC; CreateDate: 10.12.2013; LatestRevisionDate: 10.12.2013
IC6 IC14 = TXB0304RUTR: 4-bit Bidirectional Auto-direction Sensing Translator with Fully Symmetric 0.9V to 3.6V Range; Manufacturer: TEXAS INSTRUMENTS; PressFit: No; Bonding: No; Manufacturer Part Number: TXB0304RUTR; PackageDescription: SON, TEXAS RUT (R-PUQFN-N12), 0.50mm Pitch, 12-pin, 1.70mm W  X 2.00mm L X 0.55mm Height; Part Description: 4-bit Bidirectional Auto-direction Sensing Translator with Fully Symmetric 0.9V to 3.6V Range; Part Number: TXB0304RUTR; Component Kind: Standard; Component Type: Standard; Device: TXB0304RUTR; Pin Count: 12; Case: QFN12; Mounted: Yes; Socket: No; SMD: Yes; Sense: No; ComponentHeight: 0.55mm; Author: CERN DEM JLC; HelpURL: \\cern.ch\dfs\Applications\Altium\Datasheets\TXB0304RUTR.pdf; CreateDate: 27.10.2014; LatestRevisionDate: 28.10.2014
IC27 = CMP-0383-00015-1: Artix-7 FPGA, 150 User I/Os, 4 GTP, 324-Ball BGA, Speed Grade 3, Extended Grade, Pb-Free; Manufacturer: Xilinx; CMTs: 5; Available User I/O: 150; GTP: 4; Speed Grades: 3; Total Block RAM: 1800 Kb; Logic Cells: 33280; ComponentLink3URL: http://www.xilinx.com/support/documentation/user_guides/ug475_7Series_Pkg_Pinout.pdf; ComponentLink3Description: Pinout; Operating Temperature Range: Extended; PackageReference: CSG-325; PackageDescription: 324-Ball Wire-Bond Chip-Scale BGA, Body 15 x 15 mm, Pitch 0.8 mm; ComponentLink4URL: http://www.xilinx.com/support/documentation/user_guides/ug475_7Series_Pkg_Pinout.pdf; ComponentLink1Description: Manufacturer URL; ComponentLink2Description: Datasheet; DatasheetVersion: Rev. 1.15; PartNumber: XC7A35T-3CSG325E; Mounting Technology: Surface Mount; ComponentLink1URL: http://www.xilinx.com/; PackageVersion: Rev. 1.11; ComponentLink2URL: http://www.xilinx.com/support/documentation/data_sheets/ds180_7Series_Overview.pdf; Maximum Distributed RAM: 400 Kb; ComponentLink4Description: Package Specification
J14 J17 = HIROSE_U.FL-R-SMT-1(10): Part Description: Up to 6GHz Ultra Small Surface Mount Male Coaxial Connectors U.FL Series; Manufacturer: HIROSE (HRS); PressFit: No; Part Number: HIROSE_U.FL-R-SMT-1(10); Component Kind: Standard; Component Type: Standard; Pin Count: 2; Family: U.FL; Mounted: Yes; Socket: No; SMD: Yes; Sense: No; Status: None; Manufacturer Part Number: U.FL-R-SMT-1(10); ComponentHeight: 1.25mm; HelpURL: \\cern.ch\dfs\Applications\Altium\Datasheets\HIROSE_U.FL-R-SMT-1(10).pdf; Author: CERN DEM JLC; CreateDate: 24.03.2010; LatestRevisionDate: 24.03.2010
J15 = SAMTEC_MTLW-106-07-L-D-250: Connector 12 Male; Manufacturer: SAMTEC; Part Description: 12 Contacts, Pitch 2.54mm, Dual Row Through Mount Straight Header (Post Lead = 6.35mm, Tail Lead 3.05mm, Insulator 1.52mm); PressFit: No; Author: CERN DEM JLC; Component Kind: Standard; Component Type: Standard; ComponentHeight: 7.87mm; CreateDate: 25.11.2013; Family: Header 12; HelpURL: \\cern.ch\dfs\Applications\Altium\Datasheets\SAMTEC_MTLW-106-07-L-D-250.pdf; LatestRevisionDate: 25.11.2013; Mounted: Yes; Part Number: SAMTEC_MTLW-106-07-L-D-250; Pin Count: 12; Sense: No; SMD: No; Socket: No; Status: None
LD1 LD20 = LED_KINGBRIGHT_KPH-1608CGCK: LED Green 1C 2A; Part Description: SMD Green LED, Case 1.6mmX0.8mm(0603), 0.65mm Thickness; Bonding: No; PressFit: No; Author: CERN DEM JLC; Color: Green; Component Kind: Standard; Component Type: Standard; ComponentHeight: 0.65mm; CreateDate: 03.07.2017; HelpURL: \\cern.ch\dfs\Applications\Altium\Datasheets\LED_KINGBRIGHT_KPH-1608CGCK.pdf; LatestRevisionDate: 03.07.2017; Manufacturer Part Number: KPH-1608CGCK; Manufacturer: KINGBRIGHT; Mounted: Yes; PackageDescription: SMT Green LED, Case 0603, Body L 1.6 x W 0.8mm H 0.65mm; Part Number: LED_KINGBRIGHT_KPH-1608CGCK; Pin Count: 2; Sense: No; SMD: Yes; Socket: No
OSC1 = OSC_50MHZ_CTS_636L3I050M00000: Oscillator 4 pins 1=OE 2=GND 3=OUT 4=VCC; Manufacturer: CTS ELECTRONIC COMPONENTS; Part Description: 3.3V, ±50ppm, 30pF, -40..85°C, HCMOS/TTL Clock Oscillator, 636 Series; Bonding: No; PressFit: No; Author: CERN DEM JMW; Component Kind: Standard; Component Type: Standard; ComponentHeight: 1.3mm; CreateDate: 22.09.2015; HelpURL: \\cern.ch\dfs\Applications\Altium\Datasheets\OSC_CTS_636.pdf; LatestRevisionDate: 22.09.2015; Mounted: Yes; PackageDescription: Oscillator, Side Concave; 2.54mm Pitch; 4 pin, 3.20mm L X 5.00mm W X 1.30mm H, IPC Medium Density; Part Number: OSC_50MHZ_CTS_636L3I050M00000; Pin Count: 4; Sense: No; SMD: Yes; Socket: No; Value: 50MHz
R31 R46 = R0402_200R_1%_0.0625W_100PPM: Resistor - 1%; Manufacturer: GENERIC; Manufacturer1 Part Number: 232270672001L; Part Description: General Purpose Thick Film Chip Resistor; TC: ±100ppm/°C; PressFit: No; Case: 0402; Manufacturer Part Number: R0402_200R_1%_0.0625W_100PPM; Manufacturer1 ComponentHeight: 0.4mm; Manufacturer1 Example: YAGEO PHYCOMP; Part Number: R0402_200R_1%_0.0625W_100PPM; Pin Count: 2; Power: 0.0625W; Sense: No; SMD: Yes; Status: Not Recommended; Tolerance: ±1%; Value: 200; Component Kind: Standard; Component Type: Standard; Mounted: Yes; Socket: No; HelpURL: \\cern.ch\dfs\Applications\Altium\Datasheets\R0402_Phycomp_RC0402.pdf; Author: CERN DEM JLC; CreateDate: 03.12.2007; LatestRevisionDate: 17.10.2012
R34 R38 R43-R45 R129 = R0402_0R_JUMPER: Resistor; Manufacturer: GENERIC; Manufacturer1 Part Number: 232270591001L; Part Description: 1A (0.05R Max DC Resistance) Zero Ohm Jumper; PressFit: No; Case: 0402; Manufacturer Part Number: R0402_0R_JUMPER; Manufacturer1 ComponentHeight: 0.4mm; Manufacturer1 Example: YAGEO PHYCOMP; Part Number: R0402_0R_JUMPER; Pin Count: 2; Sense: No; SMD: Yes; Status: Not Recommended; Value: 0; Component Kind: Standard; Component Type: Standard; Mounted: Yes; Socket: No; HelpURL: \\cern.ch\dfs\Applications\Altium\Datasheets\R0402_Phycomp_RC0402.pdf; Author: CERN DEM JLC; CreateDate: 03.12.2007; LatestRevisionDate: 17.10.2012
R36 = R0402_100R_1%_0.1W_100PPM: Resistor - 1%; Manufacturer Part Number: R0402_100R_1%_0.1W_100PPM_50V; Manufacturer: GENERIC; Manufacturer1 Part Number: ERJ2RKF1000X; Part Description: General Purpose Thick Film Chip Resistor; Power: 0.1W; TC: ±100ppm/°C; Voltage: 50V; PressFit: No; Case: 0402; Manufacturer1 ComponentHeight: 0.4mm; Manufacturer1 Example: PANASONIC; Part Number: R0402_100R_1%_0.1W_100PPM; Pin Count: 2; Sense: No; SMD: Yes; Status: Not Recommended; Tolerance: ±1%; Value: 100; Component Kind: Standard; Component Type: Standard; Mounted: Yes; Socket: No; HelpURL: \\cern.ch\dfs\Applications\Altium\Datasheets\R0402_PANASONIC_ERJ2RK.pdf; Author: CERN DEM JLC; CreateDate: 12.12.2013; LatestRevisionDate: 03.03.2015
R37 = R0402_47R_1%_0.0625W_100PPM: Resistor - 1%; Part Description: General Purpose Thick Film Chip Resistor; Manufacturer: GENERIC; Manufacturer1 Part Number: 232270674709L; TC: ±100ppm/°C; PressFit: No; Part Number: R0402_47R_1%_0.0625W_100PPM; Component Kind: Standard; Component Type: Standard; Pin Count: 2; Value: 47; Status: Not Recommended; Power: 0.0625W; Tolerance: ±1%; Manufacturer Part Number: R0402_47R_1%_0.0625W_100PPM; Case: 0402; Mounted: Yes; Sense: No; Socket: No; SMD: Yes; Manufacturer1 Example: YAGEO PHYCOMP; Manufacturer1 ComponentHeight: 0.4mm; HelpURL: \\cern.ch\dfs\Applications\Altium\Datasheets\R0402_Phycomp_RC0402.pdf; Author: CERN DEM JLC; CreateDate: 03.12.2007; LatestRevisionDate: 17.10.2012
R40-R42 R51 R53 R144 R146 R179 R180 = R0402_10K_1%_0.0625W_100PPM: Resistor - 1%; Manufacturer: GENERIC; Manufacturer1 Part Number: 232270671003L; Part Description: General Purpose Thick Film Chip Resistor; TC: ±100ppm/°C; PressFit: No; Case: 0402; Manufacturer Part Number: R0402_10K_1%_0.0625W_100PPM; Manufacturer1 ComponentHeight: 0.4mm; Manufacturer1 Example: YAGEO PHYCOMP; Part Number: R0402_10K_1%_0.0625W_100PPM; Pin Count: 2; Power: 0.0625W; Sense: No; SMD: Yes; Status: Not Recommended; Tolerance: ±1%; Value: 10k; Component Kind: Standard; Component Type: Standard; Mounted: Yes; Socket: No; HelpURL: \\cern.ch\dfs\Applications\Altium\Datasheets\R0402_Phycomp_RC0402.pdf; Author: CERN DEM JLC; CreateDate: 03.12.2007; LatestRevisionDate: 17.10.2012
R47 R48 = R0402_240R_1%_0.0625W_100PPM: Resistor - 1%; Manufacturer: GENERIC; Manufacturer1 Part Number: 232270672401L; Part Description: General Purpose Thick Film Chip Resistor; TC: ±100ppm/°C; PressFit: No; Case: 0402; Manufacturer Part Number: R0402_240R_1%_0.0625W_100PPM; Manufacturer1 ComponentHeight: 0.4mm; Manufacturer1 Example: YAGEO PHYCOMP; Part Number: R0402_240R_1%_0.0625W_100PPM; Pin Count: 2; Power: 0.0625W; Sense: No; SMD: Yes; Status: Not Recommended; Tolerance: ±1%; Value: 240; Component Kind: Standard; Component Type: Standard; Mounted: Yes; Socket: No; HelpURL: \\cern.ch\dfs\Applications\Altium\Datasheets\R0402_Phycomp_RC0402.pdf; Author: CERN DEM JLC; CreateDate: 03.12.2007; LatestRevisionDate: 17.10.2012
R49 = R0402_NO-VALUE: Resistor; Part Description: Reserved Footprint For a 0402 (1005) Chip Resistor; PressFit: No; Mounted: No; Case: 0402; Manufacturer Part Number: R0402_NO-VALUE; Manufacturer: Undefined; Manufacturer1 ComponentHeight: Undefined; Manufacturer1 Example: Undefined; Manufacturer1 Part Number: Undefined; Part Number: R0402_NO-VALUE; Pin Count: 2; Sense: No; SMD: Yes; Status: None; Value: Undefined; Component Kind: Standard; Component Type: Standard; Socket: No; HelpURL: Undefined; Author: CERN DEM JLC; CreateDate: 03.12.2007; LatestRevisionDate: 13.03.2008
R52 = R0402_1K_1%_0.0625W_100PPM: Resistor - 1%; Manufacturer: GENERIC; Manufacturer1 Part Number: 232270671002L; Part Description: General Purpose Thick Film Chip Resistor; TC: ±100ppm/°C; PressFit: No; Case: 0402; Manufacturer Part Number: R0402_1K_1%_0.0625W_100PPM; Manufacturer1 ComponentHeight: 0.4mm; Manufacturer1 Example: YAGEO PHYCOMP; Part Number: R0402_1K_1%_0.0625W_100PPM; Pin Count: 2; Power: 0.0625W; Sense: No; SMD: Yes; Status: Not Recommended; Tolerance: ±1%; Value: 1k; Component Kind: Standard; Component Type: Standard; Mounted: Yes; Socket: No; HelpURL: \\cern.ch\dfs\Applications\Altium\Datasheets\R0402_Phycomp_RC0402.pdf; Author: CERN DEM JLC; CreateDate: 03.12.2007; LatestRevisionDate: 17.10.2012
R60 R125 R244 R245 = R0402_10K_1%_0.0625W_100PPM: Resistor - 1%; Manufacturer: GENERIC; Manufacturer1 Part Number: 232270671003L; Part Description: General Purpose Thick Film Chip Resistor; PressFit: No; TC: ±100ppm/°C; Author: CERN DEM JLC; Case: 0402; Component Kind: Standard; Component Type: Standard; CreateDate: 03.12.2007; HelpURL: \\cern.ch\dfs\Applications\Altium\Datasheets\R0402_Phycomp_RC0402.pdf; LatestRevisionDate: 17.10.2012; Manufacturer Part Number: R0402_10K_1%_0.0625W_100PPM; Manufacturer1 ComponentHeight: 0.4mm; Manufacturer1 Example: YAGEO PHYCOMP; Mounted: Yes; Part Number: R0402_10K_1%_0.0625W_100PPM; Pin Count: 2; Power: 0.0625W; Sense: No; SMD: Yes; Socket: No; Status: Not Recommended; Tolerance: ±1%; Value: 10k
R74 R243 = R0402_470R_1%_0.0625W_100PPM: Resistor - 1%; Manufacturer: GENERIC; Manufacturer1 Part Number: 232270674701L; Part Description: General Purpose Thick Film Chip Resistor; PressFit: No; TC: ±100ppm/°C; Author: CERN DEM JLC; Case: 0402; Component Kind: Standard; Component Type: Standard; CreateDate: 03.12.2007; HelpURL: \\cern.ch\dfs\Applications\Altium\Datasheets\R0402_Phycomp_RC0402.pdf; LatestRevisionDate: 17.10.2012; Manufacturer Part Number: R0402_470R_1%_0.0625W_100PPM; Manufacturer1 ComponentHeight: 0.4mm; Manufacturer1 Example: YAGEO PHYCOMP; Mounted: Yes; Part Number: R0402_470R_1%_0.0625W_100PPM; Pin Count: 2; Power: 0.0625W; Sense: No; SMD: Yes; Socket: No; Status: Not Recommended; Tolerance: ±1%; Value: 470
R143 = R0402_100R_1%_0.0625W_100PPM: Resistor - 1%; Manufacturer: GENERIC; Part Description: General Purpose Thick Film Chip Resistor; Manufacturer1 Part Number: 232270671001L; TC: ±100ppm/°C; PressFit: No; Manufacturer Part Number: R0402_100R_1%_0.0625W_100PPM; Part Number: R0402_100R_1%_0.0625W_100PPM; Tolerance: ±1%; Value: 100; Component Kind: Standard; Component Type: Standard; Pin Count: 2; Status: Not Recommended; Power: 0.0625W; Case: 0402; Mounted: Yes; Sense: No; Socket: No; SMD: Yes; Manufacturer1 Example: YAGEO PHYCOMP; Manufacturer1 ComponentHeight: 0.4mm; HelpURL: \\cern.ch\dfs\Applications\Altium\Datasheets\R0402_Phycomp_RC0402.pdf; Author: CERN DEM JLC; CreateDate: 03.12.2007; LatestRevisionDate: 17.10.2012
R145 R147 = R0402_49R9_1%_0.0625W_100PPM: Resistor - 1%; Manufacturer: GENERIC; Part Description: General Purpose Thick Film Chip Resistor; Manufacturer1 Part Number: 232270674999L or RC0402FR-0749R9L; TC: ±100ppm/°C; PressFit: No; Manufacturer Part Number: R0402_49R9_1%_0.0625W_100PPM; Part Number: R0402_49R9_1%_0.0625W_100PPM; Tolerance: ±1%; Value: 49R9; Component Kind: Standard; Component Type: Standard; Pin Count: 2; Status: Not Recommended; Power: 0.0625W; Case: 0402; Mounted: Yes; Sense: No; Socket: No; SMD: Yes; Manufacturer1 Example: YAGEO PHYCOMP; Manufacturer1 ComponentHeight: 0.4mm; HelpURL: \\cern.ch\dfs\Applications\Altium\Datasheets\R0402_Phycomp_RC0402.pdf; Author: CERN DEM JLC; CreateDate: 24.10.2012; LatestRevisionDate: 24.10.2012
T1 T8 = BSS138LT1G: N-CHANNEL MOSFET WITH DIODE; Manufacturer: ON SEMICONDUCTOR; Part Description: 50V 200mA N-Channel Enhancement Mode Field-Effect Transistor; Bonding: No; PressFit: No; Case: SOT23-3; ComponentHeight: 1.11mm; Device: BSS138LT1G; Manufacturer Part Number: BSS138LT1G; Mounted: Yes; PackageDescription: SOT23 3-Leads, Pitch 0.95mm - Body 1.4x3mm, IPC Medium Density; Part Number: BSS138LT1G; Pin Count: 3; Sense: No; SMD: Yes; Socket: No; Component Kind: Standard; Component Type: Standard; HelpURL: \\cern.ch\dfs\Applications\Altium\Datasheets\BSS138LT1G.pdf; Author: CERN DEM JLC; CreateDate: 23.03.2009; LatestRevisionDate: 23.03.2009